# Altium schematic sheet TelecarMasterDriverStc8051.SchDoc
size 190 x 120 mm; PageSetup: Record=PageOptions?CenterHorizontal=True?CenterVertical=True?PrintScale=0.67?XCorrection=1.00?YCorrection=1.00?PrintKind=1?BorderSize=5000000?LeftOffset=0?BottomOffset=0?Orientation=2?PaperLength=1000?PaperWidth=1000?Scale=100?PaperSource=7?PrintQuality=-4?MediaType=1?DitherType=10?PaperKind=A5?PrintScaleMode=1
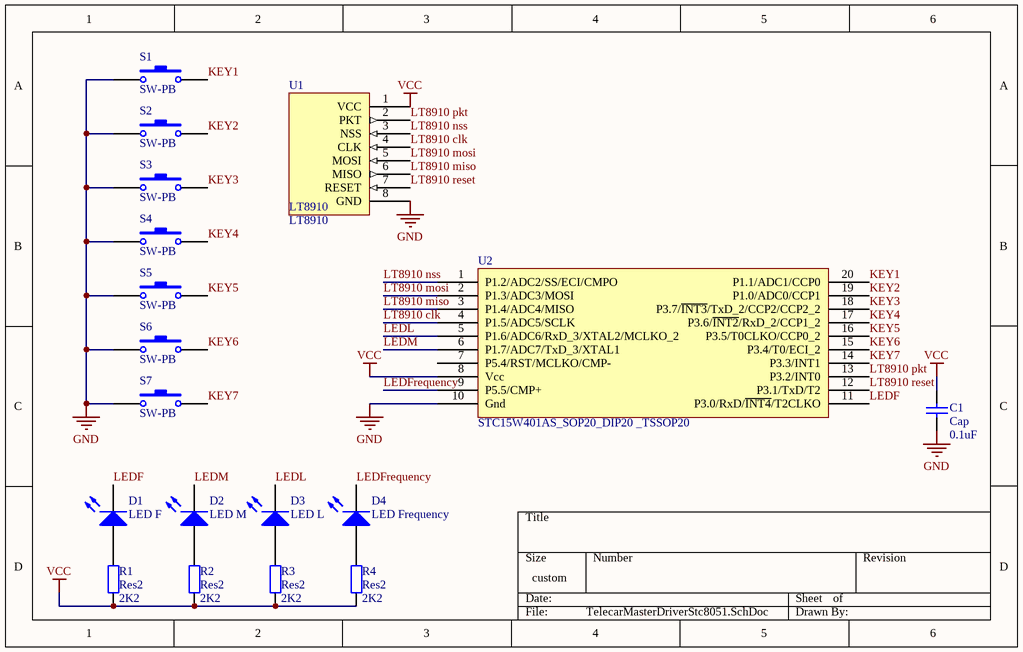
[diagram p0: TelecarMasterDriverStc8051.SchDoc]

## Parts
C1  Cap  value 0.1uF  [RAD-0.3]
D1  LED F  [LED-1]
D2  LED M  [LED-1]
D3  LED L  [LED-1]
D4  LED Frequency  [LED-1]
R1  Res2  value 2K2  [AXIAL-0.4]
R2  Res2  value 2K2  [AXIAL-0.4]
R3  Res2  value 2K2  [AXIAL-0.4]
R4  Res2  value 2K2  [AXIAL-0.4]
S1  SW-PB  [SPST-2]
S2  SW-PB  [SPST-2]
S3  SW-PB  [SPST-2]
S4  SW-PB  [SPST-2]
S5  SW-PB  [SPST-2]
S6  SW-PB  [SPST-2]
S7  SW-PB  [SPST-2]
U1  LT8910
U2  STC15W401AS_SOP20_DIP20 _TSSOP20  [TSSOP20]

## Nets
GND: C1.1 S1.1 S2.1 S3.1 S4.1 S5.1 S6.1 S7.1 U1.8(GND) U2.10(Gnd)
VCC: C1.2 R1.1 R2.1 R3.1 R4.1 U1.1(VCC) U2.8(Vcc)
KEY1: S1.2 U2.20(P1.1/ADC1/CCP0)
KEY2: S2.2 U2.19(P1.0/ADC0/CCP1)
KEY3: S3.2 U2.18(P3.7/~{INT3}/TxD_2/CCP2/CCP2_2)
KEY4: S4.2 U2.17(P3.6/~{INT2}/RxD_2/CCP1_2)
KEY5: S5.2 U2.16(P3.5/T0CLKO/CCP0_2)
KEY6: S6.2 U2.15(P3.4/T0/ECI_2)
KEY7: S7.2 U2.14(P3.3/INT1)
LEDF: D1.2(K) U2.11(P3.0/RxD/~{INT4}/T2CLKO)
LEDFrequency: D4.2(K) U2.9(P5.5/CMP+)
LEDL: D3.2(K) U2.5(P1.6/ADC6/RxD_3/XTAL2/MCLKO_2)
LEDM: D2.2(K) U2.6(P1.7/ADC7/TxD_3/XTAL1)
LT8910 clk: U1.4(CLK) U2.4(P1.5/ADC5/SCLK)
LT8910 miso: U1.6(MISO) U2.3(P1.4/ADC4/MISO)
LT8910 mosi: U1.5(MOSI) U2.2(P1.3/ADC3/MOSI)
LT8910 nss: U1.3(NSS) U2.1(P1.2/ADC2/SS/ECI/CMPO)
LT8910 pkt: U1.2(PKT) U2.13(P3.2/INT0)
LT8910 reset: U1.7(RESET) U2.12(P3.1/TxD/T2)
NetD1_1: D1.1(A) R1.2
NetD2_1: D2.1(A) R2.2
NetD3_1: D3.1(A) R3.2
NetD4_1: D4.1(A) R4.2

Not connected (* = marked no-connect by the designer): U2 7(P5.4/RST/MCLKO/CMP-)

## Library data of the parts
C1 = Cap: Capacitor; Published: 8-Jun-2000; LatestRevisionDate: 17-Jul-2002; LatestRevisionNote: Re-released for DXP Platform.; PackageReference: RAD-0.3; Publisher: Altium Limited
D1-D4 = LED1: Typical RED GaAs LED; Published: 8-Jun-2000; LatestRevisionDate: 08-Jul-2005; LatestRevisionNote: Mech Layer 1 removed.; PackageReference: LED-1; Publisher: Altium Limited
R1-R4 = Res2: Resistor; Published: 8-Jun-2000; LatestRevisionDate: 17-Jul-2002; LatestRevisionNote: Re-released for DXP Platform.; PackageReference: AXIAL-0.4; Publisher: Altium Limited
S1-S7 = SW-PB: Switch; Published: 24-Mar-1999; LatestRevisionDate: 17-Jul-2002; LatestRevisionNote: Re-released for DXP Platform.; PackageReference: SPST-2; Publisher: Altium Limited